# Altium schematic sheet USB2_Replication.SchDoc
size B; SheetNumber: 4; SheetTotal: 10
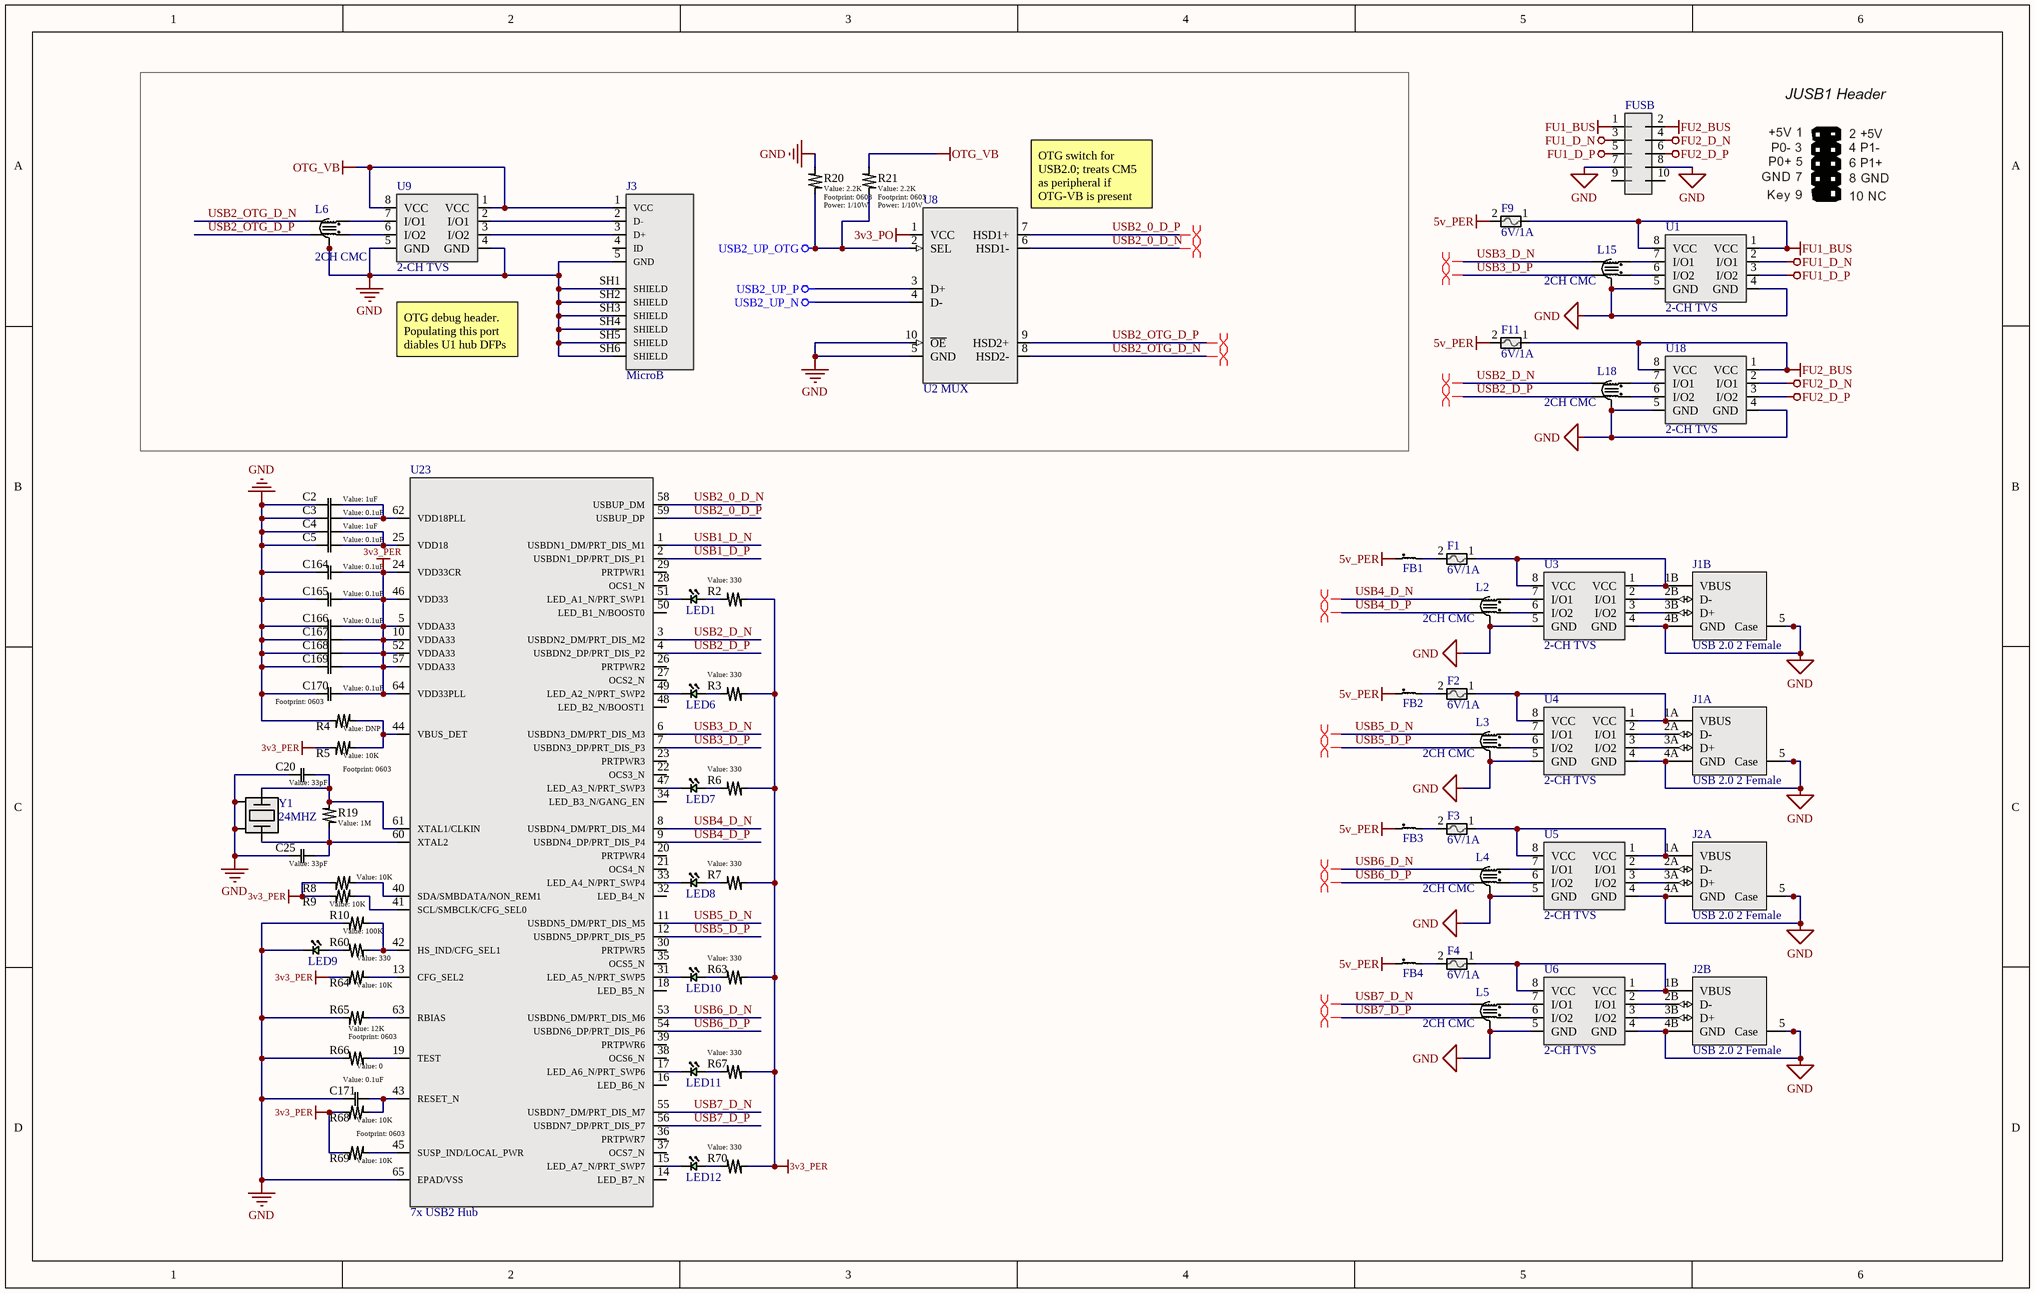
[diagram p0: USB2_Replication.SchDoc]

## Parts
C2  value 1uF  [0603]  (hidden comment: Generic Capacitor)
C3  value 0.1uF  [0603]  (hidden comment: Generic Capacitor)
C4  value 1uF  [0603]  (hidden comment: Generic Capacitor)
C5  value 0.1uF  [0603]  (hidden comment: Generic Capacitor)
C20  value 33pF  [0603]  (hidden comment: Generic Capacitor)
C25  value 33pF  [0603]  (hidden comment: Generic Capacitor)
C164  value 0.1uF  [0603]  (hidden comment: Generic Capacitor)
C165  value 0.1uF  [0603]  (hidden comment: Generic Capacitor)
C166  value 0.1uF  [0603]  (hidden comment: Generic Capacitor)
C167  Generic Capacitor  [0603]  (value not drawn)
C168  Generic Capacitor  [0603]  (value not drawn)
C169  Generic Capacitor  [0603]  (value not drawn)
C170  value 0.1uF  [0603]  (hidden comment: Generic Capacitor)
C171  value 0.1uF  [0603]  (hidden comment: Generic Capacitor)
F1  6V/1A  [0805]
F2  6V/1A  [0805]
F3  6V/1A  [0805]
F4  6V/1A  [0805]
F9  6V/1A  [0805]
F11  6V/1A  [0805]
FB1  0603 Ferrite  [0603]  (value not drawn)
FB2  0603 Ferrite  [0603]  (value not drawn)
FB3  0603 Ferrite  [0603]  (value not drawn)
FB4  0603 Ferrite  [0603]  (value not drawn)
FUSB  10pinMobo  [10pinMobo]  (value not drawn)
J1  USB 2.0 2 Female  [907-111A1022D10200]  (parts A,B of 2)
J2  USB 2.0 2 Female  [907-111A1022D10200]  (parts A,B of 2)
J3  MicroB  [10118194-0001LF]
L2  2CH CMC  [SMD-6-2CH]
L3  2CH CMC  [SMD-6-2CH]
L4  2CH CMC  [SMD-6-2CH]
L5  2CH CMC  [SMD-6-2CH]
L6  2CH CMC  [SMD-6-2CH]
L15  2CH CMC  [SMD-6-2CH]
L18  2CH CMC  [SMD-6-2CH]
LED1  LTST-C191KGKT  [0603 (1608 Metric) Concave]  (value not drawn)
LED6  LTST-C191KGKT  [0603 (1608 Metric) Concave]  (value not drawn)
LED7  LTST-C191KGKT  [0603 (1608 Metric) Concave]  (value not drawn)
LED8  LTST-C191KGKT  [0603 (1608 Metric) Concave]  (value not drawn)
LED9  LTST-C191KGKT  [0603 (1608 Metric) Concave]  (value not drawn)
LED10  LTST-C191KGKT  [0603 (1608 Metric) Concave]  (value not drawn)
LED11  LTST-C191KGKT  [0603 (1608 Metric) Concave]  (value not drawn)
LED12  LTST-C191KGKT  [0603 (1608 Metric) Concave]  (value not drawn)
R2  value 330  [0603]  (hidden comment: Generic Resistor)
R3  value 330  [0603]  (hidden comment: Generic Resistor)
R4  value DNP  [0603]  (hidden comment: Generic Resistor)
R5  value 10K  [0603]  (hidden comment: Generic Resistor)
R6  value 330  [0603]  (hidden comment: Generic Resistor)
R7  value 330  [0603]  (hidden comment: Generic Resistor)
R8  value 10K  [0603]  (hidden comment: Generic Resistor)
R9  value 10K  [0603]  (hidden comment: Generic Resistor)
R10  value 100K  [0603]  (hidden comment: Generic Resistor)
R19  value 1M  [0603]  (hidden comment: Generic Resistor)
R20  value 2.2K  Power: 1/10W  [0603]  (hidden comment: Generic Resistor)
R21  value 2.2K  Power: 1/10W  [0603]  (hidden comment: Generic Resistor)
R60  value 330  [0603]  (hidden comment: Generic Resistor)
R63  value 330  [0603]  (hidden comment: Generic Resistor)
R64  value 10K  [0603]  (hidden comment: Generic Resistor)
R65  value 12K  [0603]  (hidden comment: Generic Resistor)
R66  value 0  [0603]  (hidden comment: Generic Resistor)
R67  value 330  [0603]  (hidden comment: Generic Resistor)
R68  value 10K  [0603]  (hidden comment: Generic Resistor)
R69  value 10K  [0603]  (hidden comment: Generic Resistor)
R70  value 330  [0603]  (hidden comment: Generic Resistor)
U1  2-CH TVS  [8-SOIC]
U3  2-CH TVS  [8-SOIC]
U4  2-CH TVS  [8-SOIC]
U5  2-CH TVS  [8-SOIC]
U6  2-CH TVS  [8-SOIC]
U8  U2 MUX  [MSOP-10]
U9  2-CH TVS  [8-SOIC]
U18  2-CH TVS  [8-SOIC]
U23  7x USB2 Hub  [QFN-64]
Y1  24MHZ  [SMD2520-4P]

## Nets
3v3_PER: C164.1 C165.1 C166.1 C167.1 C168.1 C169.1 C170.1 R2.2 R3.2 R5.1 R6.2 R7.2 R8.1 R9.1 R63.2 R64.1 R67.2 R68.1 R69.1 R70.2 U23.5(VDDA33) U23.10(VDDA33) U23.24(VDD33CR) U23.46(VDD33) U23.52(VDDA33) U23.57(VDDA33) U23.64(VDD33PLL)
3v3_PO: U8.1(VCC)
5v_PER: F9.2 F11.2 FB1.1 FB2.1 FB3.1 FB4.1
FU1_BUS: F9.1 FUSB.1 U1.1(VCC) U1.8(VCC)
FU1_D_N: FUSB.3 U1.2(I/O1)
FU1_D_P: FUSB.5 U1.3(I/O2)
FU2_BUS: F11.1 FUSB.2 U18.1(VCC) U18.8(VCC)
FU2_D_N: FUSB.4 U18.2(I/O1)
FU2_D_P: FUSB.6 U18.3(I/O2)
GND: C2.2 C3.2 C4.2 C5.2 C20.2 C25.2 C164.2 C165.2 C166.2 C167.2 C168.2 C169.2 C170.2 C171.2 FUSB.7 FUSB.8 J1.4A(GND) J1.4B(GND) J1.5(Case) J2.4A(GND) J2.4B(GND) J2.5(Case) J3.5(GND) J3.SH1(SHIELD) J3.SH2(SHIELD) J3.SH3(SHIELD) J3.SH4(SHIELD) J3.SH5(SHIELD) J3.SH6(SHIELD) L2.5 L2.6 L3.5 L3.6 L4.5 L4.6 L5.5 L5.6 L6.5 L6.6 L15.5 L15.6 L18.5 L18.6 LED9.1(Cathode) R4.1 R10.1 R20.1 R65.1 R66.1 U1.4(GND) U1.5(GND) U3.4(GND) U3.5(GND) U4.4(GND) U4.5(GND) U5.4(GND) U5.5(GND) U6.4(GND) U6.5(GND) U8.5(GND) U8.10(~{OE}) U9.4(GND) U9.5(GND) U18.4(GND) U18.5(GND) U23.65(EPAD/VSS) Y1.2(GND) Y1.4(GND)
OTG_VB: J3.1(VCC) R21.1 U9.1(VCC) U9.8(VCC)
USB2_UP_N: U8.4(D-)
USB2_UP_OTG: R20.2 R21.2 U8.2(SEL)
USB2_UP_P: U8.3(D+)
USB1_D_N: U23.1(USBDN1_DM/PRT_DIS_M1)
USB1_D_P: U23.2(USBDN1_DP/PRT_DIS_P1)
USB2_0_D_N: U8.6(HSD1-) U23.58(USBUP_DM)
USB2_0_D_P: U8.7(HSD1+) U23.59(USBUP_DP)
USB2_D_N: L18.4 U23.3(USBDN2_DM/PRT_DIS_M2)
USB2_D_P: L18.3 U23.4(USBDN2_DP/PRT_DIS_P2)
USB2_OTG_D_N: L6.4 U8.8(HSD2-)
USB2_OTG_D_P: L6.3 U8.9(HSD2+)
USB3_D_N: L15.4 U23.6(USBDN3_DM/PRT_DIS_M3)
USB3_D_P: L15.3 U23.7(USBDN3_DP/PRT_DIS_P3)
USB4_D_N: L2.4 U23.8(USBDN4_DM/PRT_DIS_M4)
USB4_D_P: L2.3 U23.9(USBDN4_DP/PRT_DIS_P4)
USB5_D_N: L3.4 U23.11(USBDN5_DM/PRT_DIS_M5)
USB5_D_P: L3.3 U23.12(USBDN5_DP/PRT_DIS_P5)
USB6_D_N: L4.4 U23.53(USBDN6_DM/PRT_DIS_M6)
USB6_D_P: L4.3 U23.54(USBDN6_DP/PRT_DIS_P6)
USB7_D_N: L5.4 U23.55(USBDN7_DM/PRT_DIS_M7)
USB7_D_P: L5.3 U23.56(USBDN7_DP/PRT_DIS_P7)
NetC2_1: C2.1 C3.1 U23.62(VDD18PLL)
NetC4_1: C4.1 C5.1 U23.25(VDD18)
NetC20_1: C20.1 R19.1 U23.61(XTAL1/CLKIN) Y1.1
NetC25_1: C25.1 R19.2 U23.60(XTAL2) Y1.3
NetC171_1: C171.1 R68.2 U23.43(RESET_N)
NetF1_1: F1.1 J1.1B(VBUS) U3.1(VCC) U3.8(VCC)
NetF1_2: F1.2 FB1.2
NetF2_1: F2.1 J1.1A(VBUS) U4.1(VCC) U4.8(VCC)
NetF2_2: F2.2 FB2.2
NetF3_1: F3.1 J2.1A(VBUS) U5.1(VCC) U5.8(VCC)
NetF3_2: F3.2 FB3.2
NetF4_1: F4.1 J2.1B(VBUS) U6.1(VCC) U6.8(VCC)
NetF4_2: F4.2 FB4.2
NetJ1_2A: J1.2A(D-) U4.2(I/O1)
NetJ1_2B: J1.2B(D-) U3.2(I/O1)
NetJ1_3A: J1.3A(D+) U4.3(I/O2)
NetJ1_3B: J1.3B(D+) U3.3(I/O2)
NetJ2_2A: J2.2A(D-) U5.2(I/O1)
NetJ2_2B: J2.2B(D-) U6.2(I/O1)
NetJ2_3A: J2.3A(D+) U5.3(I/O2)
NetJ2_3B: J2.3B(D+) U6.3(I/O2)
NetJ3_2: J3.2(D-) U9.2(I/O1)
NetJ3_3: J3.3(D+) U9.3(I/O2)
NetL2_1: L2.1 U3.7(I/O1)
NetL2_2: L2.2 U3.6(I/O2)
NetL3_1: L3.1 U4.7(I/O1)
NetL3_2: L3.2 U4.6(I/O2)
NetL4_1: L4.1 U5.7(I/O1)
NetL4_2: L4.2 U5.6(I/O2)
NetL5_1: L5.1 U6.7(I/O1)
NetL5_2: L5.2 U6.6(I/O2)
NetL6_1: L6.1 U9.7(I/O1)
NetL6_2: L6.2 U9.6(I/O2)
NetL15_1: L15.1 U1.7(I/O1)
NetL15_2: L15.2 U1.6(I/O2)
NetL18_1: L18.1 U18.7(I/O1)
NetL18_2: L18.2 U18.6(I/O2)
NetLED1_1: LED1.1(Cathode) U23.51(LED_A1_N/PRT_SWP1)
NetLED1_2: LED1.2(Anode) R2.1
NetLED6_1: LED6.1(Cathode) U23.49(LED_A2_N/PRT_SWP2)
NetLED6_2: LED6.2(Anode) R3.1
NetLED7_1: LED7.1(Cathode) U23.47(LED_A3_N/PRT_SWP3)
NetLED7_2: LED7.2(Anode) R6.1
NetLED8_1: LED8.1(Cathode) U23.33(LED_A4_N/PRT_SWP4)
NetLED8_2: LED8.2(Anode) R7.1
NetLED9_2: LED9.2(Anode) R60.1
NetLED10_1: LED10.1(Cathode) U23.31(LED_A5_N/PRT_SWP5)
NetLED10_2: LED10.2(Anode) R63.1
NetLED11_1: LED11.1(Cathode) U23.17(LED_A6_N/PRT_SWP6)
NetLED11_2: LED11.2(Anode) R67.1
NetLED12_1: LED12.1(Cathode) U23.15(LED_A7_N/PRT_SWP7)
NetLED12_2: LED12.2(Anode) R70.1
NetR4_2: R4.2 R5.2 U23.44(VBUS_DET)
NetR8_2: R8.2 U23.40(SDA/SMBDATA/NON_REM1)
NetR9_2: R9.2 U23.41(SCL/SMBCLK/CFG_SEL0)
NetR10_2: R10.2 R60.2 U23.42(HS_IND/CFG_SEL1)
NetR64_2: R64.2 U23.13(CFG_SEL2)
NetR65_2: R65.2 U23.63(RBIAS)
NetR66_2: R66.2 U23.19(TEST)
NetR69_2: R69.2 U23.45(SUSP_IND/LOCAL_PWR)

Not connected (* = marked no-connect by the designer): FUSB 9 10; J3 4(ID); U23 14(LED_B7_N) 16(LED_B6_N) 18(LED_B5_N) 20(PRTPWR4) 21(OCS4_N) 22(OCS3_N) 23(PRTPWR3) 26(PRTPWR2) 27(OCS2_N) 28(OCS1_N) 29(PRTPWR1) 30(PRTPWR5) 32(LED_B4_N) 34(LED_B3_N/GANG_EN) 35(OCS5_N) 36(PRTPWR7) 37(OCS7_N) 38(OCS6_N) 39(PRTPWR6) 48(LED_B2_N/BOOST1) 50(LED_B1_N/BOOST0)

## Layout directives
differential pair: USB2_0_D_N, USB2_0_D_P, USB2_D_N, USB2_D_P, USB2_OTG_D_N, USB2_OTG_D_P, USB3_D_N, USB3_D_P, USB4_D_N, USB4_D_P, USB5_D_N, USB5_D_P, USB6_D_N, USB6_D_P, USB7_D_N, USB7_D_P

## Notes on the sheet
- (near U8) OTG switch for USB2.0; treats CM5 as peripheral if OTG-VB is present
- OTG debug header. Populating this port diables U1 hub DFPs
- REV
- REVISIONS
- DATE
- DESCRIPTION
- BY
- UNLESS OTHERWISE SPECIFIED, DRAWING DEFINITIONS AND TOLERANCES SHALL BE FOUND UNDER SUPPLIER STANDARDS SS-001. THIS PART AND ALL COMPONENTS OF IT MUST BE RoHS & REACH COMPLIANT. A CERTIFICATE OF COMPLIANCE MUST BE PROVIDED UPON REQUEST.
- ALL INFORMATION ON THIS DOCUMENT IS THE SOLE PROPERTY OF GAMBER-JOHNSON AND SHALL NOT BE COPIED, REPRODUCED, USED OR DISCLOSED IN WHOLE OR IN PART WITHOUT THE WRITTEN CONSENT OF GAMBER-JOHNSON
- TOLERANCES
  .00 ± .060
  .000 ± .020
  .0000 ± .005
  ANGELS ± 1°
- DRAWN BY:
- PROJECT NUMBER:
- SHEET TITLE:
- SHEET
- OF
- DATE:
- LOCATION:
- ASSEMBLY NUMBER
- SIZE
- GAMBER-JOHNSON LLC
  5001 JOERNS DR.
  STEVENS POINT, WI 54481
  +1 (715) 344-5209
- B

## Library data of the parts
C2-C5 C20 C25 C164-C166 C170 C171 = Generic Capacitor: Voltage: 10V; Tolerance: 10%
C167-C169 = Generic Capacitor: Voltage: 10V; Tolerance: 10%; Value: 0.1uF
F1-F4 F9 F11 = 0ZCK0100FF2E: Polymeric PTC Resettable Fuse 6V 1 A Ih Surface Mount 0805 (2012 Metric), Concave; Manufacturer: Bel; Max Current Rating: 40A; Hold Current: 1A; Trip Current: 1.95A; Time to Trip: 0.3s; Supplier 1: Digi-Key; Supplier Part Number 1: 507-1815-1-ND; Manufacturer Part Number: 0ZCK0100FF2E; RoHS: Yes; Category: PTC Resettable Fuses; Stock 1: 74738; Pricing 1: 1=0.27000, 5=0.26600, 10=0.25400, 50=0.22620, 100=0.21060, 250=0.18720, 500=0.15600, 1000=0.14820 (USD); Mount: Surface Mount; Case/Package: 0805; Case Code (Metric): 2012; Case Code (Imperial): 0805; Contact Plating: Tin,Matte; Min Operating Temperature: -40°C; Max Operating Temperature: 85°C; Package Quantity: 1; Packaging: Tape and Reel; RoHS Compliant: Yes; ComponentLink1URL: https://datasheet.ciiva.com/18550/0zck-18550620.pdf?src-supplier=Digi-Key; ComponentLink1Description: https://datasheet.ciiva.com/18550/0zck-18550620.pdf?src-supplier=Digi-Key; ComponentLink2URL: https://datasheet.ciiva.com/18550/0zck-18550621.pdf?src-supplier=Digi-Key; ComponentLink2Description: https://datasheet.ciiva.com/18550/0zck-18550621.pdf?src-supplier=Digi-Key; ComponentLink3URL: https://datasheet.ciiva.com/18550/0zck-18550622.pdf?src-supplier=Digi-Key; ComponentLink3Description: https://datasheet.ciiva.com/18550/0zck-18550622.pdf?src-supplier=Digi-Key; LCSC PN: C883112
FB1-FB4 = PE-0603FB121ST: 120 Ohms @ 100 MHz 1 Signal Line Ferrite Bead 0603 (1608 Metric) 500mA 180mOhm; Manufacturer: Pulse; Number of Lines: 1; DC Resistance (DCR): 180mR; Supplier 1: Digi-Key; Supplier Part Number 1: 553-2382-1-ND; Manufacturer Part Number: PE-0603FB121ST; RoHS: Yes; Category: Inductors; Stock 1: 6181; Pricing 1: 1=0.10000, 10=0.04400, 25=0.03920, 50=0.03580, 100=0.03220, 250=0.02360, 500=0.01716, 1000=0.01680 (USD); Mount: Surface Mount; Case/Package: 0603; Case Code (Metric): 1608; Case Code (Imperial): 0603; Min Operating Temperature: -40°C; Max Operating Temperature: 105°C; Package Quantity: 4000; Packaging: Tape and Reel; Max Current Rating: 500mA; Length: 0.063inch; Width: 0.031inch; Height: 0.037inch; RoHS Compliant: Yes; ComponentLink1URL: https://productfinder.pulseeng.com/doc_type/WEB301/doc_num/WC706/doc_part/WC706.pdf?src-supplier=Digi-Key; ComponentLink1Description: https://productfinder.pulseeng.com/doc_type/WEB301/doc_num/WC706/doc_part/WC706.pdf?src-supplier=Digi-Key; ComponentLink2URL: http://productfinder.pulseeng.com/products/datasheets/WC706.pdf?src-supplier=Digi-Key; ComponentLink2Description: http://productfinder.pulseeng.com/products/datasheets/WC706.pdf?src-supplier=Digi-Key; LCSC PN: C275486
FUSB = 10pinMobo: 10pin motherboard jack
J1 J2 = 907-111A1022D10200: USB 2.0 2 8 Female Type-A Plugin USB Connectors ROHS; LCSC PN: C12049
J3 = 10118194-0001LF: Micro USB, Input Output Connectors, B TYPE RECEPTACLE with flange; MF: Amphenol ICC; SnapEDA_Link: https://www.snapeda.com/parts/10118194-0001LF/Amphenol+FCI/view-part/?ref=snap; Package: None; Value: *; MP: 10118194-0001LF; Check_prices: https://www.snapeda.com/parts/10118194-0001LF/Amphenol+FCI/view-part/?ref=eda; LCSC PN: C132563
L2-L6 L15 L18 = ICMEF112P350MFR: 35Ω@100MHz -40℃~+85℃ 4Ω 5V 2 100mA SMD Common Mode Filters ROHS; LCSC PN: C396460; Supplier 1: Mouser; Supplier Part Number 1: 710-748020024
LED1 LED6-LED12 = CMP-013-000000-1: LED Uni-Color Green 574nm 2-Pin Chip LED T/R; Manufacturer 1: Vishay Lite-On; Number of Elements: 1; Viewing Angle: 130°; Lens Transparency: Clear; Power Dissipation: 75mW; Test Current: 20mA; Lens Style: Rectangular,Colorless; Reverse Voltage: 5V; Lens Color: Colorless; Forward Current: 30mA; Dominant Wavelength: 571nm; Forward Voltage: 2V; Luminous Intensity: 35mcd; Case Code (Imperial): 0603; Width: 0.8mm; Depth: 0.8mm; Case Code (Metric): 1608; Packaging: Tape and Reel; Number of LEDs: 1; Lead Free: Lead Free; Package Quantity: 1; Illumination Color: Green; Design Item ID: LTST-C191KGKT; Color: Green; Mount: Surface Mount; Source: Diodes.SchLib; Radiation Hardening: No; Wavelength: 574nm; RoHS: Yes; Max Power Dissipation: 75mW; RoHS Compliant: Yes; Power Rating: 75mW; Case/Package: 0603; Length: 1.6mm; Component Type: Standard; Number of Pins: 2; Height: 0.55mm; Stock 1: 4150; Pin Count: 2; ComponentLink1Description: https://datasheet.ciiva.com/2109/ltst-c191kgkt-2109973.pdf?src-supplier=Digi-Key; Manufacturer Part Number 1: LTST-C191KGKT; Category: LEDs; Min Operating Temperature: -55°C; ComponentLink1URL: https://datasheet.ciiva.com/2109/ltst-c191kgkt-2109973.pdf?src-supplier=Digi-Key; Max Operating Temperature: 85°C; Pricing 1: 50=0.14800, 250=0.06800, 500=0.06400, 1250=0.05400, 2500=0.05100 (USD)
R2-R10 R19 R60 R63-R70 = Generic Resistor: Tolerance: 1%; Power: 1/10W
R20 R21 = Generic Resistor: Tolerance: 1%
U1 U3-U6 U9 U18 = USB6B1RL: TVS DIODE 5.25VWM 8-SOIC; Mfr_Name: STMicroelectronics; RefDes: RefDes; Type: Type; Supplier 1: Future Electronics; Supplier Part Number 1: 5702279; LCSC PN: C10508
U8 = FSUSB42MUX: FSUSB42 Series DPDT 4.3 V 480 Mbps SMT Hi Speed USB 2.0 Switch - MSOP-10; MF: ON Semiconductor; SnapEDA_Link: https://www.snapeda.com/parts/FSUSB42MUX/Onsemi/view-part/?ref=snap; Package: MSOP-10 ON Semiconductor; Value: *; MP: FSUSB42MUX; Check_prices: https://www.snapeda.com/parts/FSUSB42MUX/Onsemi/view-part/?ref=eda; LCSC PN: C11355; Supplier 1: Digikey; Supplier Part Number 1: FSUSB42MUXCT-ND
U23 = USB2517-JZX: USB Hub Controller USB 2.0 USB Interface 64-QFN (9x9); Mfr_Name: Microchip; RefDes: RefDes; Type: Type; LCSC PN: C1521556; Supplier 1: Avnet; Supplier Part Number 1: USB2517I-JZX; Supplier 2: Newark; Supplier Part Number 2: 66W2139; Supplier 3: Newark; Supplier Part Number 3: 41AH8631
Y1 = CM4024M00020001: 24MHz 20pF ±10ppm ±30ppm SMD-2520-4P Crystals ROHS; LCSC PN: C7294628